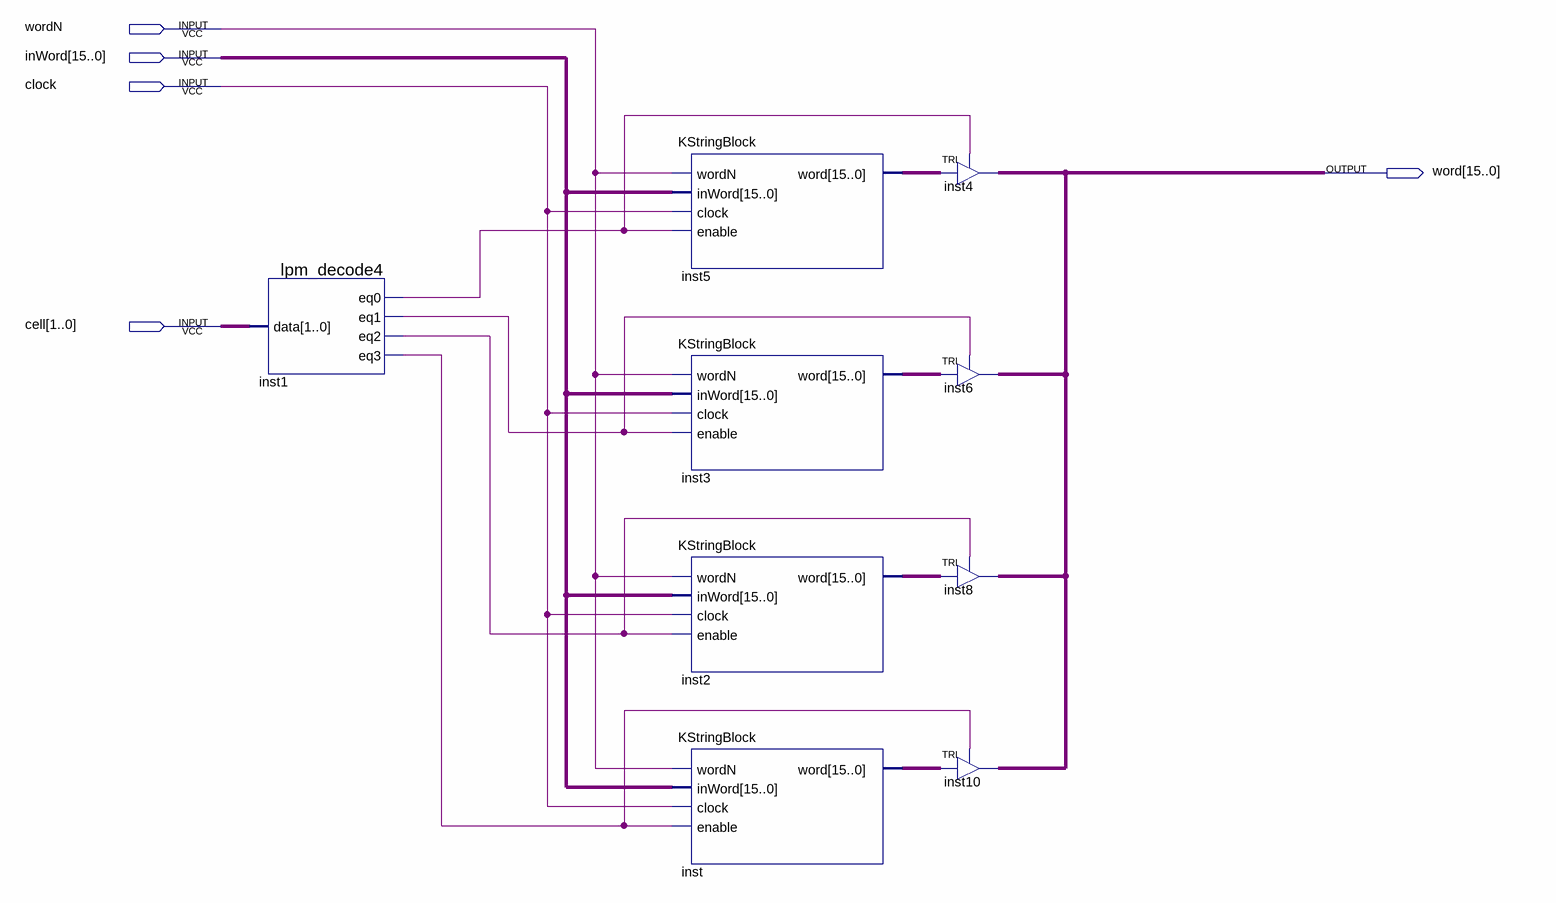
[diagram p0: schematic sheet]
// Quartus schematic cacheMemoryString.bdf as structural Verilog: 9 symbols, 5 pins
module cacheMemoryString (
  input  wordN,
  input  [15:0] inWord,
  input  clock,
  input  [1:0] \cell ,
  output [15:0] word
);

  wire inst1_eq0, inst1_eq1, inst1_eq2, inst1_eq3;
  wire [15:0] inst2_word, inst3_word, inst5_word, inst_word;

  lpm_decode4 inst1 (.data(\cell ), .eq0(inst1_eq0), .eq1(inst1_eq1), .eq2(inst1_eq2), .eq3(inst1_eq3));
  KStringBlock inst5 (.wordN(wordN), .inWord(inWord), .clock(clock), .enable(inst1_eq0), .word(inst5_word));
  KStringBlock inst3 (.wordN(wordN), .inWord(inWord), .clock(clock), .enable(inst1_eq1), .word(inst3_word));
  KStringBlock inst2 (.wordN(wordN), .inWord(inWord), .clock(clock), .enable(inst1_eq2), .word(inst2_word));
  KStringBlock inst (.wordN(wordN), .inWord(inWord), .clock(clock), .enable(inst1_eq3), .word(inst_word));
  TRI inst4[15:0] (.IN(inst5_word), .OE(inst1_eq0), .OUT(word));
  TRI inst6[15:0] (.IN(inst3_word), .OE(inst1_eq1), .OUT(word));
  TRI inst8[15:0] (.IN(inst2_word), .OE(inst1_eq2), .OUT(word));
  TRI inst10[15:0] (.IN(inst_word), .OE(inst1_eq3), .OUT(word));
endmodule
